# EAGLE board 197504_Kalibrierumschaltbaugruppe_seriell_2017_09_06_komplett (EAGLE 6.4), part 1 of 2
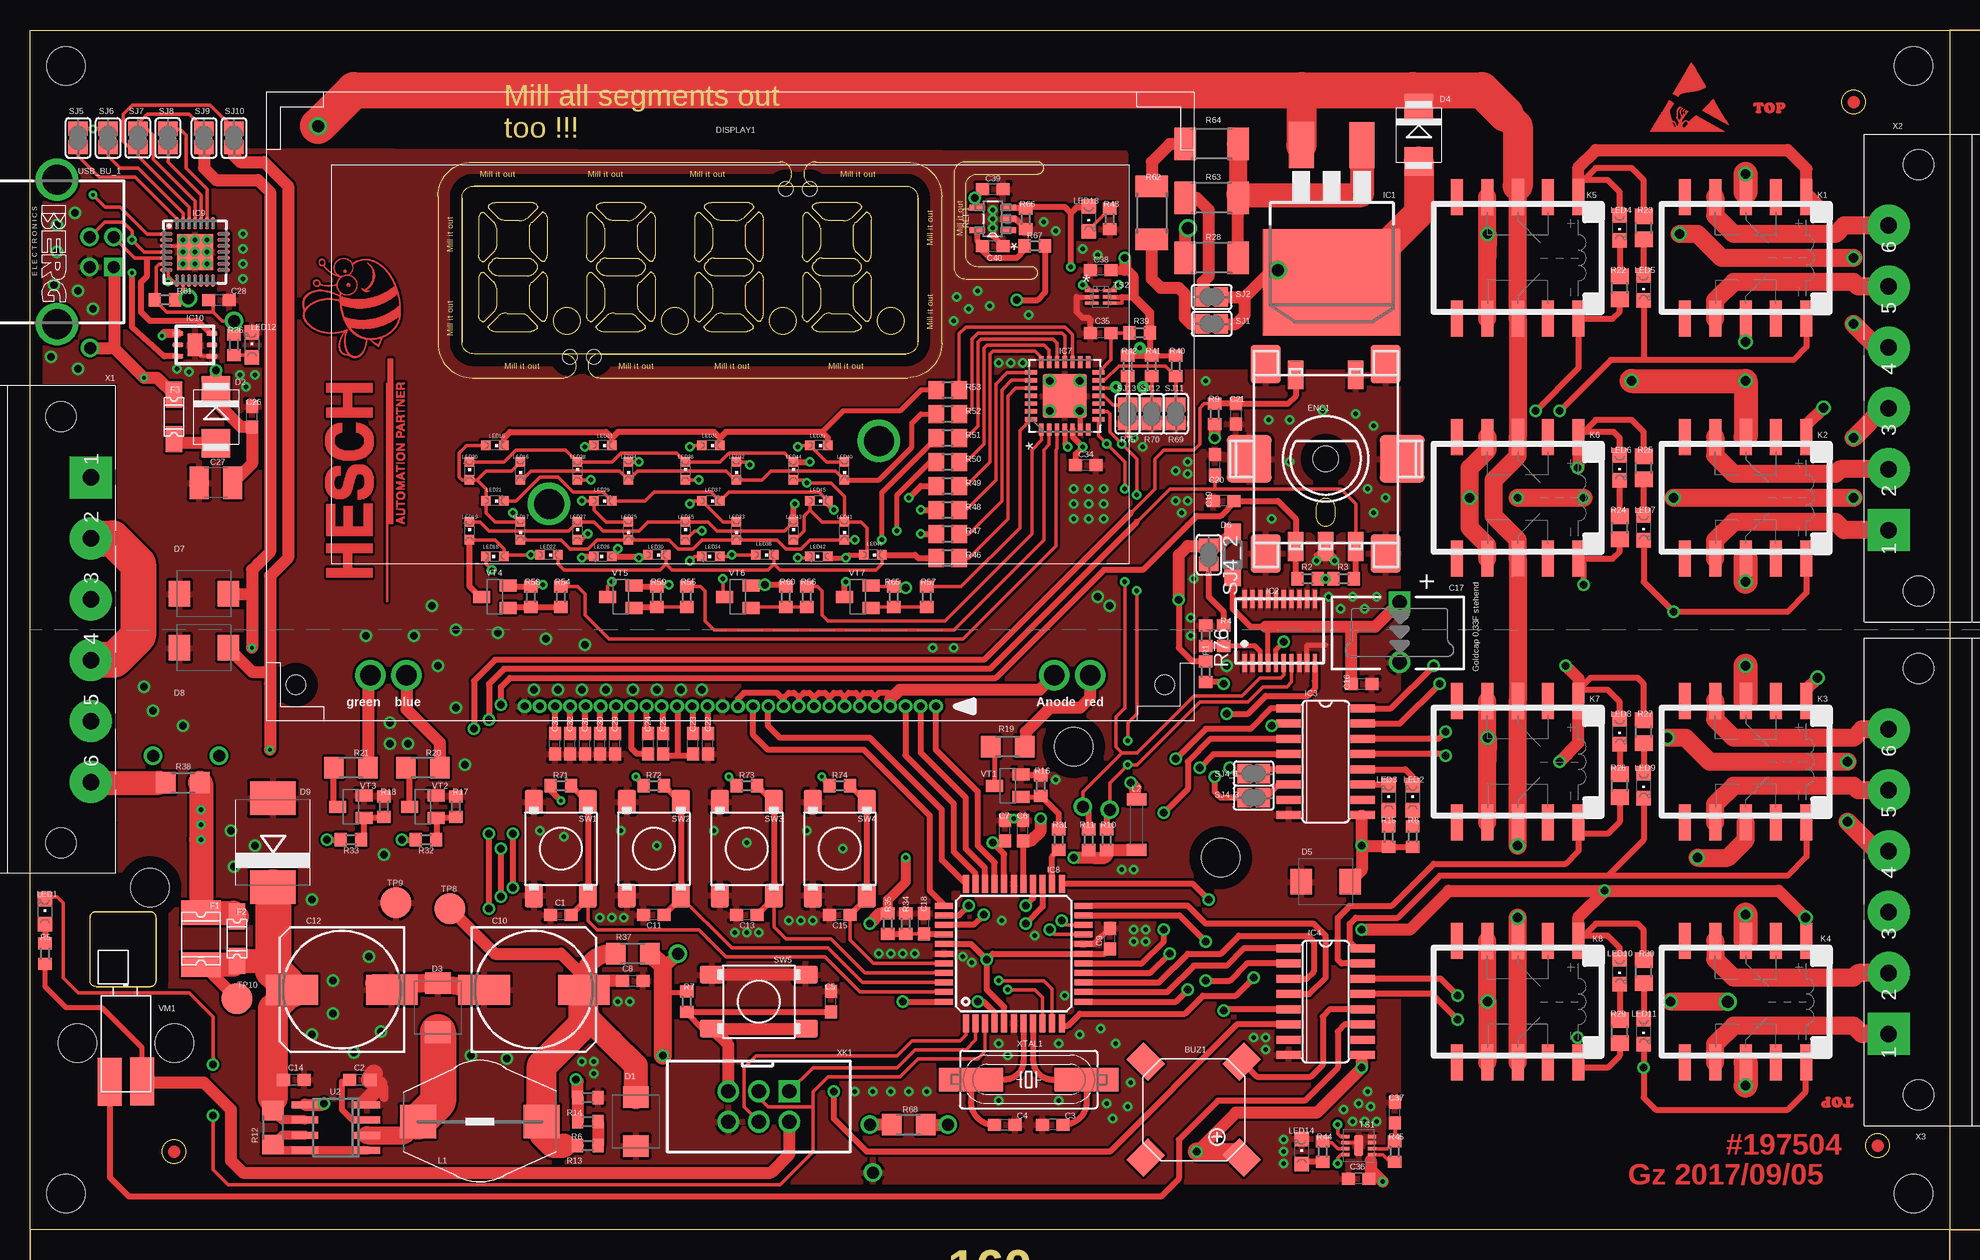
[diagram p8: board, top side]
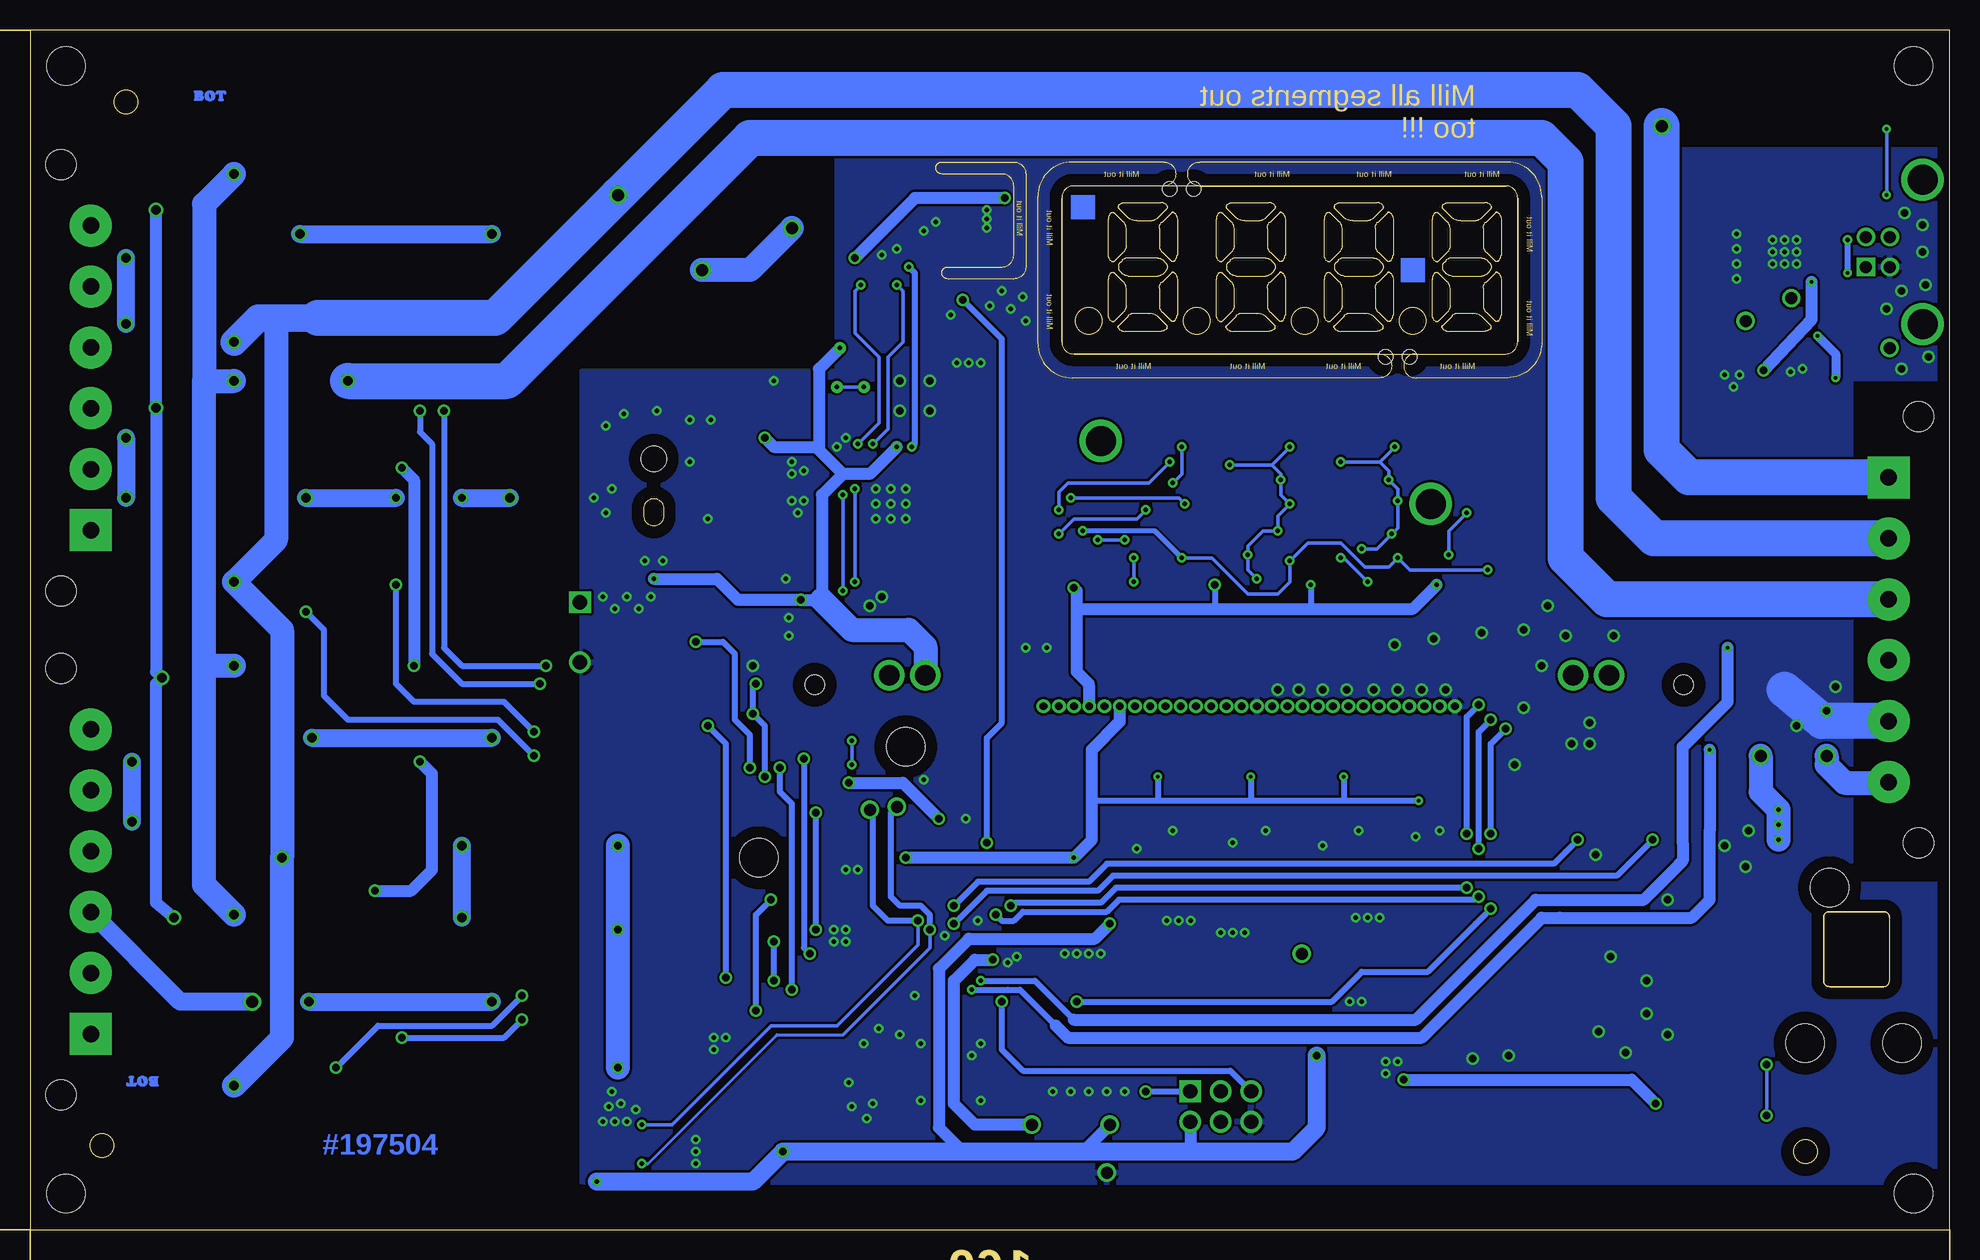
[diagram p9: board, bottom side, seen from below]

Size 160 x 100 mm. Coordinates in mm from the lower left corner, seen from the top.
Outline: 160,100 160,0 0,0 0,100 160,100
Outline: 5.5,20.25 arc-90 5,20.75 5,26 arc-90 5.5,26.5 10,26.5 arc-90 10.5,26 10.5,20.75 arc-90 10,20.25 5.5,20.25
Outline: 73,87 arc-90 74,86 74,74 arc-90 73,73 37,73 arc-90 36,74 36,86 arc-90 37,87 73,87
Copper layers (1*16): Top 0.035mm / dielectric 1.5mm / Bottom 0.035mm
Design rules "default *": minimum track width 10mil, minimum drill 0.6mm, track to track 8mil, track to pad 8mil, pad to pad 8mil, via to via 8mil, smd to smd 8mil, copper to edge 40mil, drill to drill 8mil, minimum pad ring 10mil, minimum via ring 8mil, stop-mask expansion 4mil, vias tented up to drill 50mil, thermal gap 10mil
Holes 3.2 mm at 3,97 3,3 157,3 157,97 10,28.5 99.25,31 87,40.25
Holes 1.2 mm at 63,86.75 65,86.75 45,72.75 47,72.75
tRestrict: area 0,97 to 160,100; area 0,0 to 160,3
Milling: area 0,-5.3 to 1.5,-4.7; area 158.5,-5.3 to 160,-4.7; area 76.5,-4.6 to 83.5,-1.6; area 164.7,98.5 to 165.3,100; area 164.7,0 to 165.3,1.5; area 165.4,46.5 to 168.4,53.5; 58 lines

## Footprints (pad centres in the part's own frame; a part is rotated, then mirrored left to right if it is on the bottom)
SMD = smd 2.5 x 2 rotated 225: 1 -4,-4 | smd 2.5 x 2 rotated 315: 2 4,-4 | smd 2.5 x 2 rotated 45: 3 4,4 | smd 2.5 x 2 rotated 135: 4 -4,4
C0603 = smd 1.1 x 1: 1 -0.85,0; 2 0.85,0
153CLV-1014 = smd 4.3 x 2.5: + 4.15,0; - -4.15,0
PANASONIC_SD_SERIES_STEHEND = drill 1.2 square: + -2.54,-6.35 | drill 1.2: - 2.46,-6.35
C1210 = smd 1.6 x 2.7: 1 -1.4,0; 2 1.4,0
SMBJ = smd 1.78 x 2.16: A 2.04,0; C -2.03,0
DO-214AA/SMB = smd 2.4 x 2.4: A 2.2,0; C -2.2,0
SOD123 = smd 1.4 x 1.4: A 1.9,0; C -1.9,0
SMC = smd 2.8 x 3.8: A 3.7,0; C -3.7,0
DISPLAYTECH_64128M-FCBW-RGB_COG_SERIES_GLCD-128X68COG = drill 0.65: 1 17.14,-25; 2 15.87,-25; 3 14.6,-25; 4 13.33,-25; 5 12.06,-25; 6 10.79,-25; 7 9.52,-25; 8 8.25,-25; 9 6.98,-25; 10 5.71,-25; 11 4.44,-25; 12 3.17,-25; 13 1.9,-25; 14 0.63,-25; 15 -0.64,-25; 16 -1.91,-25; 17 -3.18,-25; 18 -4.45,-25; 19 -5.72,-25; 20 -6.99,-25; 21 -8.26,-25; 22 -9.53,-25; 23 -10.8,-25; 24 -12.07,-25; 25 -13.34,-25; 26 -14.61,-25; 27 -15.88,-25; 28 -17.15,-25 | drill 1.7: A 27,-22.41; KB -27,-22.41; KG -30,-22.41; KR 30,-22.41 | hole 1.6: -36.2,-23.2; 36.2,-23.2
BOURNS_PEC11S = smd 1.3 x 2.4: A -2.5,-7.3; B 2.5,-7.3; C 0,-7.3; D -2.5,7; E 2.5,7 | smd 2.5 x 3.2: SHIELD_1 -5,-7.9; SHIELD_2 5,-7.9; SHIELD_4 5,7.9; SHIELD_5 -5,7.9 | smd 3.75 x 4: SHIELD_3 6.375,0; SHIELD_6 -6.375,0 | hole 2.1: 0,0
1812L = smd 2.03 x 3.3: 1 -2.16,0; 2 2.16,0
1206L = smd 2.16 x 1.4: 1 -1.85,0; 2 1.85,0
D2PACK = smd 2.083 x 3.81: 1 -2.54,-8.89; 3 2.54,-8.89 | smd 11.43 x 8.89: 2 0,2.54
VSOJ20 = smd 0.35 x 1.5: 1 0,0; 2 0.65,0; 3 1.3,0; 4 1.95,0; 5 2.6,0; 6 3.25,0; 7 3.9,0; 8 4.55,0; 9 5.2,0; 10 5.85,0; 11 5.85,5.3; 12 5.2,5.3; 13 4.55,5.3; 14 3.9,5.3; 15 3.25,5.3; 16 2.6,5.3; 17 1.95,5.3; 18 1.3,5.3; 19 0.65,5.3; 20 0,5.3
SO16 = smd 0.66 x 2.032: 1 -4.445,-3.073; 2 -3.175,-3.073; 3 -1.905,-3.073; 4 -0.635,-3.073; 5 0.635,-3.073; 6 1.905,-3.073; 7 3.175,-3.073; 8 4.445,-3.073; 9 4.445,3.073; 10 3.175,3.073; 11 1.905,3.073; 12 0.635,3.073; 13 -0.635,3.073; 14 -1.905,3.073; 15 -3.175,3.073; 16 -4.445,3.073
QFN28_RM_0,65 = smd 1 x 0.36: 1 -2.794,1.95; 2 -2.794,1.3; 3 -2.794,0.65; 4 -2.794,0; 5 -2.794,-0.65; 6 -2.794,-1.3; 7 -2.794,-1.95; 15 2.794,-1.95; 16 2.794,-1.3; 17 2.794,-0.65; 18 2.794,0; 19 2.794,0.65; 20 2.794,1.3; 21 2.794,1.95 | smd 0.36 x 1: 8 -1.95,-2.794; 9 -1.3,-2.794; 10 -0.65,-2.794; 11 0,-2.794; 12 0.65,-2.794; 13 1.3,-2.794; 14 1.95,-2.794; 22 1.95,2.794; 23 1.3,2.794; 24 0.65,2.794; 25 0,2.794; 26 -0.65,2.794; 27 -1.3,2.794; 28 -1.95,2.794 | smd 3.7 x 3.7: 29 0,0
TQFP44 = smd 1.5 x 0.5: 1 -5.8,4; 2 -5.8,3.2; 3 -5.8,2.4; 4 -5.8,1.6; 5 -5.8,0.8; 6 -5.8,0; 7 -5.8,-0.8; 8 -5.8,-1.6; 9 -5.8,-2.4; 10 -5.8,-3.2; 11 -5.8,-4; 23 5.8,-4; 24 5.8,-3.2; 25 5.8,-2.4; 26 5.8,-1.6; 27 5.8,-0.8; 28 5.8,0; 29 5.8,0.8; 30 5.8,1.6; 31 5.8,2.4; 32 5.8,3.2; 33 5.8,4 | smd 0.5 x 1.5: 12 -4,-5.8; 13 -3.2,-5.8; 14 -2.4,-5.8; 15 -1.6,-5.8; 16 -0.8,-5.8; 17 0,-5.8; 18 0.8,-5.8; 19 1.6,-5.8; 20 2.4,-5.8; 21 3.2,-5.8; 22 4,-5.8; 34 4,5.8; 35 3.2,5.8; 36 2.4,5.8; 37 1.6,5.8; 38 0.8,5.8; 39 0,5.8; 40 -0.8,5.8; 41 -1.6,5.8; 42 -2.4,5.8; 43 -3.2,5.8; 44 -4,5.8
QFN28 = smd 1 x 0.3: 1 -2.4,1.5; 2 -2.4,1; 3 -2.4,0.5; 4 -2.4,0; 5 -2.4,-0.5; 6 -2.4,-1; 7 -2.4,-1.5; 15 2.4,-1.5; 16 2.4,-1; 17 2.4,-0.5; 18 2.4,0; 19 2.4,0.5; 20 2.4,1; 21 2.4,1.5 | smd 0.3 x 1: 8 -1.5,-2.4; 9 -1,-2.4; 10 -0.5,-2.4; 11 0,-2.4; 12 0.5,-2.4; 13 1,-2.4; 14 1.5,-2.4; 22 1.5,2.4; 23 1,2.4; 24 0.5,2.4; 25 0,2.4; 26 -0.5,2.4; 27 -1,2.4; 28 -1.5,2.4 | smd 3 x 3: THERMAL 0,0
DRS = smd 0.35 x 0.9: 1 -0.95,-1.425; 2 0,-1.425; 3 0.95,-1.425; 4 0.95,1.425; 5 0,1.425; 6 -0.95,1.425 | smd 1.9 x 1.2: THERMAL 0,0
PANASONIC_TQ_SMD = smd 1 x 3: 1 -5.08,-5.08; 2 -2.54,-5.08; 3 0,-5.08; 4 2.54,-5.08; 5 5.08,-5.08; 6 5.08,5.08; 7 2.54,5.08; 8 0,5.08; 9 -2.54,5.08; 10 -5.08,5.08
L = smd 3 x 2.8: 1 -5.15,0; 2 5.15,0
L4516C = smd 1 x 1.6: 1 -2.1,0; 2 2.1,0
CHIPLED_0805 = smd 1.2 x 1.2: A 0,-1.05; C 0,1.05
CHIPLED_0603 = smd 0.8 x 0.8: A 0,-0.75; C 0,0.75
R0603 = smd 1 x 1.1: 1 -0.85,0; 2 0.85,0
R0603' = smd 0.9 x 1.1: 1 -0.85,0; 2 0.85,0
R1206 = smd 1.6 x 1.803: 1 -1.422,0; 2 1.422,0
R0805 = smd 1.3 x 1.5: 1 -0.95,0; 2 0.95,0
R2010 = smd 1.8 x 2.7: 1 -2.2,0; 2 2.2,0
SOT95P284X122-5N = smd 1.27 x 0.533: 1 -1.295,0.94; 2 -1.295,0; 3 -1.295,-0.94; 4 1.295,-0.94; 5 1.295,0.94
SJ = smd 1.168 x 1.6: 1 -0.762,0; 2 0.762,0
DTSM6 = smd 2 x 1.5: 1 -3.9,2.25; 2 3.9,2.25; 3 -3.9,-2.25; 4 3.9,-2.25
THT-1X2,54 = drill 1 pad 1.5: TP 0,0
B2,54 = smd 2.54 x 2.54: PP 0,0
DFN8 = smd 0.7 x 0.25: 1 -1.1,0.75; 2 -1.1,0.25; 3 -1.1,-0.25; 4 -1.1,-0.75; 5 1.1,-0.75; 6 1.1,-0.25; 7 1.1,0.25; 8 1.1,0.75 | smd 0.7 x 1.7: TH 0,0
SOT50P160X60-6N = smd 1.118 x 0.254: 1 -0.737,0.508; 2 -0.737,0; 3 -0.737,-0.508; 4 0.737,-0.508; 5 0.737,0; 6 0.737,0.508
SOIC8 = smd 0.6 x 2.2: 1 -1.905,-2.6; 2 -0.635,-2.6; 3 0.635,-2.6; 4 1.905,-2.6; 5 1.905,2.6; 6 0.635,2.6; 7 -0.635,2.6; 8 -1.905,2.6
PN61729-S = drill 1 square: 1 1.25,4.71 | drill 1: 2 -1.25,4.71; 3 -1.25,2.71; 4 1.25,2.71 | drill 2.5 pad 3.5: S1 -6.02,0; S2 6.02,0
LA4-436B = smd 4 x 2: P$1 -0.85,1.35; P$2 -0.8,-1.35 | hole 3.2: -4.05,4.05; -4.05,-4.05
SOT23-BEC = smd 1 x 1.4: B -0.95,-1.1; C 0,1.1; E 0.95,-1.1
MSTB6_GF = drill 1.397 pad 3.5 square: 1 -12.7,5.08 | drill 1.397 pad 3.5: 2 -7.62,5.08; 3 -2.54,5.08; 4 2.54,5.08; 5 7.62,5.08; 6 12.7,5.08 | hole 2.5: -17.78,2.58; 17.78,2.58
WSL = drill 1.2 square: 1 -2.54,-1.27 | drill 1.2: 2 -2.54,1.27; 3 0,-1.27; 4 0,1.27; 5 2.54,-1.27; 6 2.54,1.27
HC49 = smd 5.334 x 1.93: 1 -4.826,0; 2 4.826,0

## Placement (x,y rotation side)
7_SEG_KONT_1  [SIEBEN_SEGMENT_KONTUR_SINGLE_DIGIT]  40.25,80.25 0 top
7_SEG_KONT_2  [SIEBEN_SEGMENT_KONTUR_SINGLE_DIGIT]  49.25,80.25 0 top
7_SEG_KONT_3  [SIEBEN_SEGMENT_KONTUR_SINGLE_DIGIT]  58.25,80.25 0 top
7_SEG_KONT_4  [SIEBEN_SEGMENT_KONTUR_SINGLE_DIGIT]  67.25,80.25 0 top
BUZ1  CA-M-SMD  [SMD]  97,10 180 top
C1  100n  [C0603]  44.25,26.25 180 top
C2  470p  [C0603]  27.5,12.5 0 top
C3  22p  [C0603]  85.25,8.75 180 top
C4  22p  [C0603]  81.25,8.75 0 top
C5  100n  [C0603]  66.75,19 90 top
C6  100n  [C0603]  82.75,33.25 90 top
C7  100n  [C0603]  81.25,33.25 90 top
C8  100n  [C0603]  50.25,20.75 0 top
C9  100n  [C0603]  90,24.25 90 top
C10  017008 / 220µ / 50V  [153CLV-1014]  42,20 0 top
C11  100n  [C0603]  52,26.25 180 top
C12  017008 / 220µ / 50V  [153CLV-1014]  26,20 180 top
C13  100n  [C0603]  59.75,26.25 180 top
C14  100n  [C0603]  22,12.5 0 top
C15  100n  [C0603]  67.5,26.25 180 top
C16  100n  [C0603]  111,45.5 0 top
C17  Goldcap 0,33F stehend  [PANASONIC_SD_SERIES_STEHEND]  120.5,49.75 270 top
C18  100n  [C0603]  74.5,25.5 90 top
C19  100n  [C0603]  99.5,60.75 180 top
C20  100n  [C0603]  98.75,63.75 90 top
C21  100n  [C0603]  100.5,68 270 top
C22  1µ / X7R / 25V mind.  [C0603]  56.5,40.5 90 top
C23  1µ / X7R / 25V mind.  [C0603]  55.25,40.5 90 top
C24  1µ / X7R / 25V mind.  [C0603]  51.5,40.5 270 top
C25  1µ / X7R / 25V mind.  [C0603]  52.75,40.5 90 top
C26  100n  [C0603]  18.5,67.75 90 top
C27  47µ Keram  [C1210]  15.5,62.25 180 top
C28  100n  [C0603]  15.75,77.5 0 top
C29  1µ / X7R / 25V mind.  [C0603]  48.75,40.5 90 top
C30  1µ / X7R / 25V mind.  [C0603]  47.5,40.5 90 top
C31  1µ / X7R / 25V mind.  [C0603]  46.25,40.5 90 top
C32  1µ / X7R / 25V mind.  [C0603]  45,40.5 90 top
C33  1µ / X7R / 25V mind.  [C0603]  43.75,40.5 90 top
C34  100n  [C0603]  88,63.75 0 top
C35  100n  [C0603]  89.25,74.75 180 top
C36  100n  [C0603]  110.75,4.25 180 top
C37  100n  [C0603]  113.75,9.75 90 top
C38  100n  [C0603]  89.25,80 180 top
C39  100n  [C0603]  80.25,86.75 0 top
C40  100n  [C0603]  80.25,82 0 top
D1  105068 Suppressor SMB uni 5V  [SMBJ]  50.5,9 270 top
D2  105032 SS24  [DO-214AA/SMB]  15.5,67.75 270 top
D3  SS24  [SMBJ]  34,18.5 90 top
D4  105032 SS24  [DO-214AA/SMB]  115.75,91.25 270 top
D5  Suppressor_3V3_SMB  [SMBJ]  108,29 180 top
D6  BAS116H-115  [SOD123]  100.25,56.25 90 top
D7  105068 Suppressor SMB uni 5V  [SMBJ]  14.5,53 180 top
D8  105068 Suppressor SMB uni 5V  [SMBJ]  14.5,48.5 180 top
D9  P6SMC33A  [SMC]  20.25,32.25 90 top
DISPLAY1  64128M-FCBW-RGB  [DISPLAYTECH_64128M-FCBW-RGB_COG_SERIES_GLCD-128X68COG]  58.38,68.62 0 top
DRILEGEND  [DRILEGEND]  0,-13 0 top  (outside the outline)
ENC1  BOURNS_PEC11S # 088034  [BOURNS_PEC11S]  108,64.25 0 top
F1  1812 / 0,5A  [1812L]  14.25,24.25 270 top
F2  025023 / 0,5 A  [1206L]  17.25,24.25 270 top
F3  025023 / 0,5 A  [1206L]  12,67.75 270 top
FIDU1  Passermarke  [PASSER_1MM]  152,94 0 top
FIDU2  Passermarke  [PASSER_1MM]  154,7 0 top
FIDU3  Passermarke  [PASSER_1MM]  12,6.5 0 top
IC1  LM317BD2T  [D2PACK]  108.5,81.5 180 top
IC2  EPSON RTC8564JE  [VSOJ20]  101.25,47.25 0 top
IC3  ULN2003AD  [SO16]  108,39 270 top
IC4  ULN2003AD  [SO16]  108,19 270 top
IC7  MCP23017T-E/ML  [QFN28_RM_0,65]  86.25,69.5 90 top
IC8  MEGA32-A  [TQFP44]  82,23 90 top
IC9  045194 CP2102SMD  [QFN28]  13.75,81.5 0 top
IC10  TPD2E001DRSR  [DRS]  13.75,73.75 270 top
K1  # 035004 / TQ2SA-3V-Z TQ2SA-3V  [PANASONIC_TQ_SMD]  143,81 180 top
K2  # 035004 / TQ2SA-3V-Z TQ2SA-3V  [PANASONIC_TQ_SMD]  143,61 180 top
K3  # 035004 / TQ2SA-3V-Z TQ2SA-3V  [PANASONIC_TQ_SMD]  143,39 180 top
K4  # 035004 / TQ2SA-3V-Z TQ2SA-3V  [PANASONIC_TQ_SMD]  143,19 180 top
K5  # 035004 / TQ2SA-3V-Z TQ2SA-3V  [PANASONIC_TQ_SMD]  124,81 180 top
K6  # 035004 / TQ2SA-3V-Z TQ2SA-3V  [PANASONIC_TQ_SMD]  124,61 180 top
K7  # 035004 / TQ2SA-3V-Z TQ2SA-3V  [PANASONIC_TQ_SMD]  124,39 180 top
K8  # 035004 / TQ2SA-3V-Z TQ2SA-3V  [PANASONIC_TQ_SMD]  124,19 180 top
L1  470µH  [L]  37.5,9 0 top
L2  Ferrit_4516 10µH  [L4516C]  92.25,33.75 90 top
LED1  0805_blue  [CHIPLED_0805]  1.25,26.5 0 top
LED2  0805_blue  [CHIPLED_0805]  115.25,36 0 top
LED3  0805_blue  [CHIPLED_0805]  113.25,36 0 top
LED4  0805_blue  [CHIPLED_0805]  132.5,83.5 180 top
LED5  0805_blue  [CHIPLED_0805]  134.5,78.5 180 top
LED6  0805_blue  [CHIPLED_0805]  132.5,63.5 180 top
LED7  0805_blue  [CHIPLED_0805]  134.5,58.5 180 top
LED8  0805_blue  [CHIPLED_0805]  132.5,41.5 180 top
LED9  0805_blue  [CHIPLED_0805]  134.5,37 180 top
LED10  0805_blue  [CHIPLED_0805]  132.5,21.5 180 top
LED11  0805_blue  [CHIPLED_0805]  134.5,16.5 180 top
LED12  0805_blue  [CHIPLED_0805]  18.5,73.75 0 top
LED13  0805_blue  [CHIPLED_0805]  88.25,84.25 180 top
LED14  0805_blue  [CHIPLED_0805]  106,6.5 0 top
LED15  LED_0603  [CHIPLED_0603]  38.75,65.38 270 top
LED16  LED_0603  [CHIPLED_0603]  40.88,63.25 180 top
LED17  LED_0603  [CHIPLED_0603]  40.88,58.25 180 top
LED18  LED_0603  [CHIPLED_0603]  38.75,56.12 90 top
LED19  LED_0603  [CHIPLED_0603]  36.62,58.25 0 top
LED20  LED_0603  [CHIPLED_0603]  36.62,63.25 0 top
LED21  LED_0603  [CHIPLED_0603]  38.75,60.75 270 top
LED22  LED_0603  [CHIPLED_0603]  43.25,56.25 270 top
LED23  LED_0603  [CHIPLED_0603]  47.75,65.38 270 top
LED24  LED_0603  [CHIPLED_0603]  49.88,63.25 180 top
LED25  LED_0603  [CHIPLED_0603]  49.88,58.25 180 top
LED26  LED_0603  [CHIPLED_0603]  47.75,56.12 90 top
LED27  LED_0603  [CHIPLED_0603]  45.62,58.25 0 top
LED28  LED_0603  [CHIPLED_0603]  45.62,63.25 0 top
LED29  LED_0603  [CHIPLED_0603]  47.75,60.75 270 top
LED30  LED_0603  [CHIPLED_0603]  52.25,56.25 270 top
LED31  LED_0603  [CHIPLED_0603]  56.75,65.38 270 top
LED32  LED_0603  [CHIPLED_0603]  58.88,63.25 180 top
LED33  LED_0603  [CHIPLED_0603]  58.88,58.25 180 top
LED34  LED_0603  [CHIPLED_0603]  56.75,56.12 90 top
LED35  LED_0603  [CHIPLED_0603]  54.62,58.25 0 top
LED36  LED_0603  [CHIPLED_0603]  54.62,63.25 0 top
LED37  LED_0603  [CHIPLED_0603]  56.75,60.75 270 top
LED38  LED_0603  [CHIPLED_0603]  61.25,56.25 270 top
LED39  LED_0603  [CHIPLED_0603]  65.75,65.38 270 top
LED40  LED_0603  [CHIPLED_0603]  67.88,63.25 180 top
LED41  LED_0603  [CHIPLED_0603]  67.88,58.25 180 top
LED42  LED_0603  [CHIPLED_0603]  65.75,56.12 90 top
LED43  LED_0603  [CHIPLED_0603]  63.62,58.25 0 top
LED44  LED_0603  [CHIPLED_0603]  63.62,63.25 0 top
LED45  LED_0603  [CHIPLED_0603]  65.75,60.75 270 top
LED46  LED_0603  [CHIPLED_0603]  70.25,56.25 270 top
R1  100k  [R0603]  98,46.5 90 top
R2  100k  [R0603]  106.5,54.25 0 top
R3  100k  [R0603]  109.5,54.25 180 top
R4  10k  [R0603]  99.5,49.5 90 top
R5  2,2k  [R0603]  1.25,23 270 top
R6  820R / 0603  [R0603']  46.5,9 0 top
R7  100k  [R0603]  54.75,19 90 top
R8  1k  [R0603]  115.25,32.75 90 top
R9  100k  [R0603]  98.75,68 270 top
R10  4,7k  [R0603]  89.75,32.5 270 top
R11  4,7k  [R0603]  88.25,32.5 270 top
R12  0,33R  [R1206]  20.25,8.5 90 top
R13  820R / 0603  [R0603']  46.5,7 180 top
R14  1k  [R0603']  46.5,11 180 top
R15  1k  [R0603]  113.25,32.75 90 top
R16  X-OHM  [R0603]  84.25,37 270 top
R17  X-OHM  [R0603]  35.5,35.25 270 top
R18  X-OHM  [R0603]  29.5,35.25 270 top
R19  22R  [R1206]  81.5,40.25 0 top
R20  22R  [R1206]  32.75,38.5 0 top
R21  22R  [R1206]  26.75,38.5 0 top
R22  1k  [R0805]  132.5,78.5 90 top
R23  1k  [R0805]  134.5,83.5 90 top
R24  1k  [R0805]  132.5,58.5 90 top
R25  1k  [R0805]  134.5,63.5 90 top
R26  1k  [R0805]  132.5,37 90 top
R27  1k  [R0805]  134.5,41.5 90 top
R28  072083 47R  [R2010]  98.5,81 180 top
R29  1k  [R0805]  132.5,16.5 90 top
R30  1k  [R0805]  134.5,21.5 90 top
R31  1k  [R0603]  85.75,32.5 270 top
R32  1k  [R0603]  33,32.5 180 top
R33  1k  [R0603]  26.75,32.5 180 top
R34  100k  [R0603]  73,25.5 270 top
R35  100k  [R0603]  71.5,25.5 270 top
R36  2,2k  [R0603]  17,73.75 90 top
R37  0R / 1206  [R1206]  50.25,23 0 top
R38  0R / 1206  [R1206]  12.75,37.25 180 top
R39  100k  [R0603]  92.5,74.75 0 top
R40  100k  [R0603]  95.5,72 90 top
R41  100k  [R0603]  93.5,72 90 top
R42  100k  [R0603]  91.5,72 90 top
R43  1k  [R0603]  90,84.25 90 top
R44  1k  [R0603]  107.75,6.5 270 top
R45  100k  [R0603]  113.75,6.5 90 top
R46  100R  [R0805]  76.5,56 0 top
R47  100R  [R0805]  76.5,58 0 top
R48  100R  [R0805]  76.5,60 0 top
R49  100R  [R0805]  76.5,62 0 top
R50  100R  [R0805]  76.5,64 0 top
R51  100R  [R0805]  76.5,66 0 top
R52  100R  [R0805]  76.5,68 0 top
R53  100R  [R0805]  76.5,70 0 top
R54  1k  [R0603]  44.25,52.75 270 top
R55  1k  [R0603]  54.75,52.75 270 top
R56  1k  [R0603]  64.75,52.75 270 top
R57  1k  [R0603]  74.75,52.75 270 top
R58  100k  [R0603]  41.75,52.75 90 top
R59  100k  [R0603]  52.25,52.75 90 top
R60  100k  [R0603]  63,52.75 90 top
R61  100k  [R0603]  11.25,77.5 0 top
R62  072083 47R  [R2010]  93.5,84.75 270 top
R63  072083 47R  [R2010]  98.5,86 180 top
R64  072083 47R  [R2010]  98.5,90.5 180 top
R65  100k  [R0603]  72,52.75 90 top
R66  100k  [R0603]  83,84.25 90 top
R67  0R 0603  [R0603]  83.75,82 0 top
R68  0R / 1206  [R1206]  73.25,8.75 180 top
R69  0R 0603  [R0603]  95.5,68 90 top
R70  0R 0603  [R0603]  93.5,68 90 top
R71  100k  [R0603]  44.25,37 0 top
R72  100k  [R0603]  52,37 0 top
R73  100k  [R0603]  59.75,37 0 top
R74  100k  [R0603]  67.5,37 0 top
R75  0R 0603  [R0603]  91.5,68 90 top
R76  100k  [R0603]  98,49.5 270 top
REF1  LM4132AMF-2.5  [SOT95P284X122-5N]  80.25,84.25 180 top
SJ1  Lötjumper  [SJ]  98.5,75.5 180 top
SJ2  Lötjumper  [SJ]  98.5,77.75 0 top
SJ4_1  Lötjumper  [SJ]  102,38 180 top
SJ4_2  Lötjumper  [SJ]  98.25,56.25 270 top
SJ4_3  Lötjumper  [SJ]  102,36 180 top
SJ5  Lötjumper  [SJ]  4,91 270 top
SJ6  Lötjumper  [SJ]  6.5,91 270 top
SJ7  Lötjumper  [SJ]  9,91 90 top
SJ8  Lötjumper  [SJ]  11.5,91 90 top
SJ9  Lötjumper  [SJ]  14.5,91 270 top
SJ10  Lötjumper  [SJ]  17,91 270 top
SJ11  Lötjumper  [SJ]  95.5,68 90 top
SJ12  Lötjumper  [SJ]  93.5,68 90 top
SJ13  Lötjumper  [SJ]  91.5,68 90 top
SW1  088037 DTSM6  [DTSM6]  44.25,31.75 90 top
SW2  088037 DTSM6  [DTSM6]  52,31.75 90 top
SW3  088037 DTSM6  [DTSM6]  59.75,31.75 90 top
SW4  088037 DTSM6  [DTSM6]  67.5,31.75 90 top
SW5  088037 DTSM6  [DTSM6]  60.75,19 0 top
TP1  Testpad_mit_Bohrung  [THT-1X2,54]  90,35 0 top
TP2  Testpad_mit_Bohrung  [THT-1X2,54]  87.75,35.25 0 top
TP3  Testpunkt_mit_Bohrung  [THT-1X2,54]  5,73.5 180 top
TP4  Testpunkt_mit_Bohrung  [THT-1X2,54]  13.2,77.65 180 top
TP5  Testpunkt_mit_Bohrung  [THT-1X2,54]  17,75.75 180 top
TP6  Testpunkt_mit_Bohrung  [THT-1X2,54]  10.25,39.5 90 top
TP7  Testpunkt_mit_Bohrung  [THT-1X2,54]  15.75,39.5 90 top
TP8  TPB2,54  [B2,54]  35,26.75 0 top
TP9  TPB2,54  [B2,54]  30.5,27.25 0 top
TP10  TPB2,54  [B2,54]  17.25,19.25 0 top
TP11  Testpunkt_mit_Bohrung  [THT-1X2,54]  54,23 0 top
TP12  Testpunkt_mit_Bohrung  [THT-1X2,54]  70.25,4.75 0 top
TP13  Testpunkt_mit_Bohrung  [THT-1X2,54]  70,8.75 0 top
TP14  Testpunkt_mit_Bohrung  [THT-1X2,54]  76.5,8.75 0 top
TS1  STS_31  [DFN8]  110.75,7 0 top
TS2  TMP102AIDRLT  [SOT50P160X60-6N]  89.25,77.75 0 top
U2  MC33063AD  [SOIC8]  25.5,8.5 90 top
U$4  [BOT]  150.62,12.38 180 top
U$5  [TOP]  150.62,10.62 180 top
U$6  [HANDHABUNGSVORSCHRIFTEN_BEACHTEN_KOMPLETT_LACKFREI]  138.5,93.5 0 top
U$7  [HESCH-LOGO-BIENE]  27.5,62.25 90 top
U$9  [BOT]  145,94.5 0 top
U$10  [TOP]  145,93.5 0 top
USB_BU_1  134577 USB_B_Bu liegend mit Schirm  [PN61729-S]  2.25,81.5 270 top
VM1  LA4-436B  [LA4-436B]  8,11.5 270 top
VT1  BC817-40  [SOT23-BEC]  81.5,37 90 top
VT2  BC817-40  [SOT23-BEC]  32.75,35.25 90 top
VT3  BC817-40  [SOT23-BEC]  26.75,35.25 90 top
VT4  BC807-40SMD  [SOT23-BEC]  38.75,52.75 90 top
VT5  BC807-40SMD  [SOT23-BEC]  49.25,52.75 90 top
VT6  BC807-40SMD  [SOT23-BEC]  59,52.75 90 top
VT7  BC807-40SMD  [SOT23-BEC]  69,52.75 90 top
X1  MSTB 2,5/6-GF-5,08 AU ( Phoenix: 1949364 )  [MSTB6_GF]  0,50 270 top
X2  MSTB 2,5/6-GF-5,08 AU ( Phoenix: 1949364 )  [MSTB6_GF]  160,71 90 top
X3  MSTB 2,5/6-GF-5,08 AU ( Phoenix: 1949364 )  [MSTB6_GF]  160,29 90 top
XK1  131239 ( Wanne_6_pol )  [WSL]  60.75,10.25 180 top
XTAL1  HC49-U / 16 MHz  [HC49]  83.25,12.5 180 top